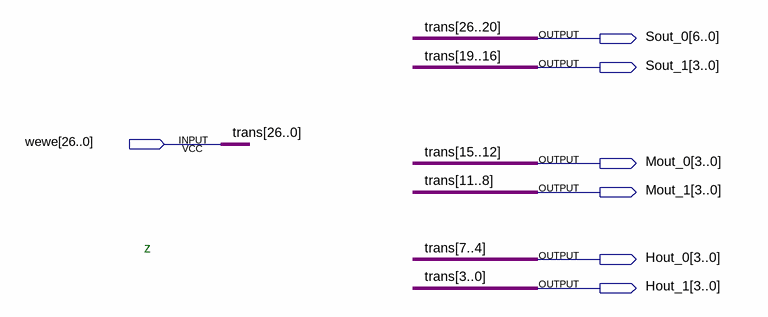
[diagram p0: schematic sheet]
// Quartus schematic show.bdf as structural Verilog: 0 symbols, 7 pins
module show (
  input  [26:0] wewe,
  output [6:0] Sout_0,
  output [3:0] Sout_1,
  output [3:0] Mout_0,
  output [3:0] Mout_1,
  output [3:0] Hout_0,
  output [3:0] Hout_1
);


  assign Hout_0 = wewe[7:4];
  assign Hout_1 = wewe[3:0];
  assign Mout_0 = wewe[15:12];
  assign Mout_1 = wewe[11:8];
  assign Sout_0 = wewe[26:20];
  assign Sout_1 = wewe[19:16];

  // Other names for the same wires on the sheet: trans[26:0] = wewe

  // Notes on the sheet:
  //   z
endmodule
